# EAGLE design BATT_CPU (EAGLE 9.6.2)
COMPANY: ADAFRUIT INDUSTRIES; DRAWN: KTOWN; REV: B
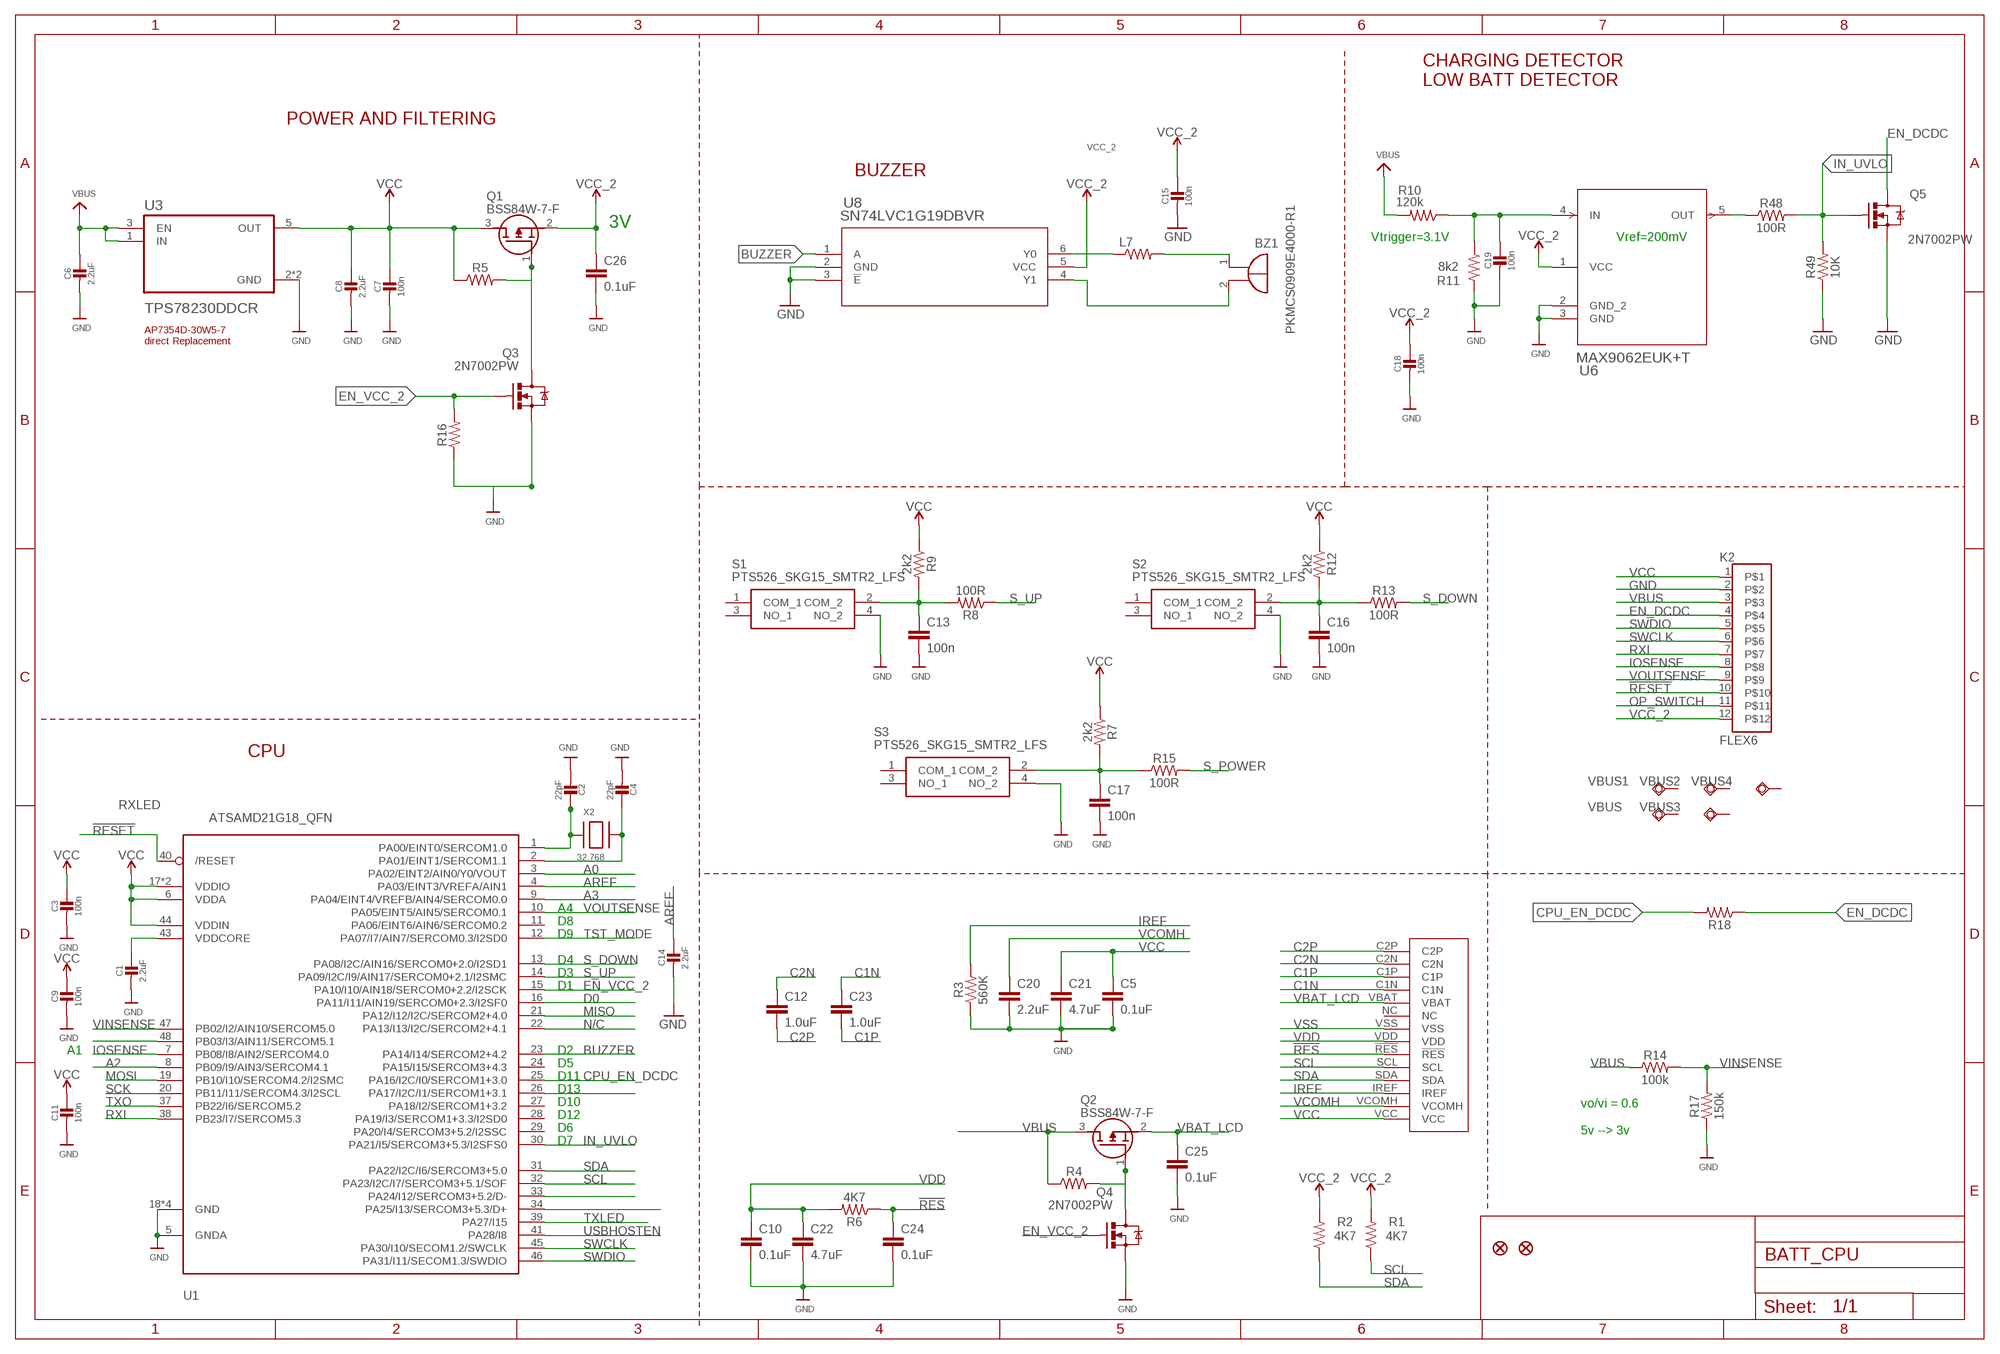
[diagram p0: schematic, sheet 1]

## Parts
BZ1  PKMCS0909E4000-R1  [PKMCS0909]
C1  2.2uF  CAP_CERAMIC0603_NO  [0603-NO]
C2  22pF  CAP_CERAMIC0603_NO  [0603-NO]
C3  100n  CAP_CERAMIC0603_NO  [0603-NO]
C4  22pF  CAP_CERAMIC0603_NO  [0603-NO]
C5  0.1uF  0.1UF-0402-16V-10%  [0402]
C6  2.2uF  CAP_CERAMIC0805-NOOUTLINE  [0805-NO]
C7  100n  CAP_CERAMIC0603_NO  [0603-NO]
C8  2.2uF  CAP_CERAMIC0805-NOOUTLINE  [0805-NO]
C9  100n  CAP_CERAMIC0603_NO  [0603-NO]
C10  0.1uF  0.1UF-0402-16V-10%  [0402]
C11  100n  CAP_CERAMIC0603_NO  [0603-NO]
C12  1.0uF  1.0UF-0402-16V-10%  [0402]
C13  100n  C-EUC0805  [C0805]
C14  2.2uF  CAP_CERAMIC0603_NO  [0603-NO]
C15  100n  CAP_CERAMIC0603_NO  [0603-NO]
C16  100n  C-EUC0805  [C0805]
C17  100n  C-EUC0805  [C0805]
C18  100n  CAP_CERAMIC0603_NO  [0603-NO]
C19  100n  CAP_CERAMIC0603_NO  [0603-NO]
C20  2.2uF  2.2UF-0603-10V-20%  [0603]
C21  4.7uF  4.7UF0603  [0603]
C22  4.7uF  4.7UF0603  [0603]
C23  1.0uF  1.0UF-0402-16V-10%  [0402]
C24  0.1uF  0.1UF-0402-16V-10%  [0402]
C25  0.1uF  0.1UF-0402-16V-10%  [0402]
C26  0.1uF  0.1UF-0402-16V-10%  [0402]
K2  FLEX6  [FLEX6]
L7  MMZ2012Y202BT000  RESISTOR0805-RES  [0805]
Q1  BSS84W-7-F  [SOT65P222X110-3N]
Q2  BSS84W-7-F  [SOT65P222X110-3N]
Q3  2N7002PW  MOSFET-NCHANNEL2N7002PW  [SOT323]
Q4  2N7002PW  MOSFET-NCHANNEL2N7002PW  [SOT323]
Q5  2N7002PW  MOSFET-NCHANNEL2N7002PW  [SOT323]
R1  4K7  RESISTOR0402  [0402]
R2  4K7  RESISTOR0402  [0402]
R3  560K  RESISTOR0402  [0402]
R4  RESISTOR0402  [0402]
R5  RESISTOR0402  [0402]
R6  4K7  RESISTOR0402  [0402]
R7  2k2  RESISTOR0402  [0402]
R8  100R  RESISTOR0402  [0402]
R9  2k2  RESISTOR0402  [0402]
R10  120k  RESISTOR0402  [0402]
R11  8k2  RESISTOR0402  [0402]
R12  2k2  RESISTOR0402  [0402]
R13  100R  RESISTOR0402  [0402]
R14  100k  RESISTOR0402  [0402]
R15  100R  RESISTOR0402  [0402]
R16  RESISTOR0402  [0402]
R17  150k  RESISTOR0402  [0402]
R18  RESISTOR0402  [0402]
R48  100R  RESISTOR0402  [0402]
R49  10K  RESISTOR0402  [0402]
S1  PTS526_SKG15_SMTR2_LFS  [PTS526SKG15SMTR2LFS]
S2  PTS526_SKG15_SMTR2_LFS  [PTS526SKG15SMTR2LFS]
S3  PTS526_SKG15_SMTR2_LFS  [PTS526SKG15SMTR2LFS]
U1  ATSAMD21G18_QFN  ATSAMD21J_QFN  [TQFN48_7MM]
U3  TPS78230DDCR  [SOT95P280X110-5N]
U6  MAX9062EUK+T  [21-0057F_MXM]
U8  SN74LVC1G19DBVR  [DBV6]
U$30  64X32_OLED_049  [LCD_14_PINS]
U$34  FIDUCIAL""  [FIDUCIAL_1MM]
U$35  FIDUCIAL""  [FIDUCIAL_1MM]
VBUS  TESTPAD_TPSQB1,27  [TESTPAD_B1,27]
VBUS1  TESTPAD_TPSQB1,27  [TESTPAD_B1,27]
VBUS2  TESTPAD_TPSQB1,27  [TESTPAD_B1,27]
VBUS3  TESTPAD_TPSQB1,27  [TESTPAD_B1,27]
VBUS4  TESTPAD_TPSQB1,27  [TESTPAD_B1,27]
X2  32.768  XTAL-3.2X1.5  [XTAL3215]

## Nets
!RES: C24.1 R6.1 U$30.!RES
!RESET: K2.10 U1.40(/RESET)
A0: U1.3(PA02/EINT2/AIN0/Y0/VOUT)
A2: U1.8(PB09/I9/AIN3/SERCOM4.1)
A3: U1.9(PA04/EINT4/VREFB/AIN4/SERCOM0.0)
AREF: C14.1 U1.4(PA03/EINT3/VREFA/AIN1)
BUZZER: U1.23(PA14/I14/SERCOM2+4.2) U8.1(A)
C1N: C23.1 U$30.C1N
C1P: C23.2 U$30.C1P
C2N: C12.1 U$30.C2N
C2P: C12.2 U$30.C2P
CPU_EN_DCDC: R18.2 U1.25(PA16/I2C/I0/SERCOM1+3.0)
D0: U1.16(PA11/I11/AIN19/SERCOM0+2.3/I2SF0)
EN_DCDC: K2.4 Q5.3(D) R18.1
EN_VCC_2: Q3.1(G) Q4.1(G) R16.2 U1.15(PA10/I10/AIN18/SERCOM0+2.2/I2SCK)
GND: C1.2 C2.2 C3.2 C4.2 C5.2 C6.2 C7.2 C8.2 C9.2 C10.2 C11.2 C13.2 C14.2 C15.2 C16.2 C17.2 C18.2 C19.2 C20.2 C21.2 C22.2 C24.2 C25.2 C26.2 K2.2 Q3.2(S) Q4.2(S) Q5.2(S) R3.1 R11.2 R16.1 R17.1 R49.1 S1.4(NO_2) S2.4(NO_2) S3.4(NO_2) U1.5(GNDA) U1.18(GND) U1.35(GND) U1.42(GND) U1.THERMAL(GND) U3.2(GND) U3.4(GND) U6.2(GND_2) U6.3(GND) U8.2(GND) U8.3(!E)
IN_UVLO: Q5.1(G) R48.2 R49.2 U1.30(PA21/I5/SERCOM3+5.3/I2SFS0)
IOSENSE: K2.8 U1.7(PB08/I8/AIN2/SERCOM4.0)
IREF: R3.2 U$30.IREF
MISO: U1.21(PA12/I12/I2C/SERCOM2+4.0)
MOSI: U1.19(PB10/I10/SERCOM4.2/I2SMC)
N$1: C17.1 R7.2 R15.1 S3.2(COM_2)
N$2: C13.1 R8.2 R9.2 S1.2(COM_2)
N$3: C16.1 R12.2 R13.1 S2.2(COM_2)
N$4: Q2.1(G) Q4.3(D) R4.2
N$5: C2.1 U1.1(PA00/EINT0/SERCOM1.0) X2.P$1
N$6: Q1.1(G) Q3.3(D) R5.2
N$7: C4.1 U1.2(PA01/EINT1/SERCOM1.1) X2.P$2
N$8: U1.39(PA27/I15)
N$9: U1.22(PA13/I13/I2C/SERCOM2+4.1)
N$10: C19.1 R10.1 R11.1 U6.4(IN)
N$11: U1.34(PA25/I13/SERCOM3+5.3/D+)
N$12: U1.41(PA28/I8)
N$13: U1.48(PB03/I3/AIN11/SERCOM5.1)
N$14: U1.33(PA24/I12/SERCOM3+5.2/D-)
N$17: L7.1 U8.6(Y0)
N$19: BZ1.1(+) L7.2
N$22: BZ1.2(-) U8.4(Y1)
N$58: R48.1 U6.5(OUT)
OP_SWITCH: K2.11 U1.26(PA17/I2C/I1/SERCOM1+3.1)
RXI: K2.7 U1.38(PB23/I7/SERCOM5.3)
S_DOWN: R13.2 U1.13(PA08/I2C/AIN16/SERCOM0+2.0/I2SD1)
S_POWER: R15.2
S_UP: R8.1 U1.14(PA09/I2C/I9/AIN17/SERCOM0+2.1/I2SMC)
SCK: U1.20(PB11/I11/SERCOM4.3/I2SCL)
SCL: R1.1 U1.32(PA23/I2C/I7/SERCOM3+5.1/SOF) U$30.SCL
SDA: R2.1 U1.31(PA22/I2C/I6/SERCOM3+5.0) U$30.SDA
SWCLK: K2.6 U1.45(PA30/I10/SECOM1.2/SWCLK)
SWDIO: K2.5 U1.46(PA31/I11/SECOM1.3/SWDIO)
TST_MODE: U1.12(PA07/I7/AIN7/SERCOM0.3/I2SD0)
TXO: U1.37(PB22/I6/SERCOM5.2)
VBAT_LCD: C25.1 Q2.2(S) U$30.VBAT
VBUS: C6.1 K2.3 Q2.3(D) R4.1 R10.2 R14.1 U3.1(IN) U3.3(EN)
VCC: C3.1 C5.1 C7.1 C8.1 C9.1 C11.1 C21.1 K2.1 Q1.3(D) R5.1 R7.1 R9.1 R12.1 U1.6(VDDA) U1.17(VDDIO) U1.36(VDDIO) U1.44(VDDIN) U3.5(OUT) U$30.VCC
VCC_2: C15.1 C18.1 C26.1 K2.12 Q1.2(S) R1.2 R2.2 U6.1(VCC) U8.5(VCC)
VCOMH: C20.1 U$30.VCOMH
VDD: C10.1 C22.1 R6.2 U$30.VDD
VDDCORE: C1.1 U1.43(VDDCORE)
VINSENSE: R14.2 R17.2 U1.47(PB02/I2/AIN10/SERCOM5.0)
VOUTSENSE: K2.9 U1.10(PA05/EINT5/AIN5/SERCOM0.1)
VSS: U$30.VSS
Unconnected: S1.1(COM_1) S1.3(NO_1) S2.1(COM_1) S2.3(NO_1) S3.1(COM_1) S3.3(NO_1) U1.11(PA06/EINT6/AIN6/SERCOM0.2) U1.24(PA15/I15/SERCOM3+4.3) U1.27(PA18/I2/SERCOM1+3.2) U1.28(PA19/I3/SERCOM1+3.3/I2SD0) U1.29(PA20/I4/SERCOM3+5.2/I2SSC) U$30.NC VBUS1.TP VBUS2.TP VBUS3.TP VBUS4.TP VBUS.TP

## Notes on the sheet
- CHARGING DETECTOR
  LOW BATT DETECTOR
- POWER AND FILTERING
- BUZZER
- 3V
- Vtrigger=3.1V | Vref=200mV
- AP7354D-30W5-7 
  direct Replacement
- CPU
- RXLED
- A4
- D8
- D9
- D4
- D3
- D1
- N/C
- A1 | D2
- D5
- D11
- D13
- D10
- D12
- D6
- vo/vi = 0.6
  
  5v --> 3v
- D7
- TXLED
- USBHOSTEN

## Library data of the parts
BZ1 = buzzer:PKMCS0909E4000-R1: PKMCS0909E4000-R1 Source : http://www.murata.com/~/media/webrenewal/products/sound/sounder/vppt-buzj083-d.ashx
C1-C4 C6-C9 C11 C14 C15 C18 C19 = microbuilder:CAP_CERAMIC: Ceramic Capacitors For new designs, use the packages preceded by an '_' character since they are more reliable: The following footprints should be used on most boards: _0402 - Standard footprint for regular board layouts _0603 - Standard footprint for regular board layouts _0805 - Standard footprint for regular board layouts _1206 - Standard footprint for regular board layouts For extremely tight-pitch boards where space is at a premium, the following 'micro-pitch' footprints can be used (smaller pads, no silkscreen outline, etc.): _0402MP - Micro-pitch footprint for very dense/compact boards _0603MP - Micro-pitch footprint for very dense/compact boards _0805MP - Micro-pitch footprint for very dense/compact boards _1206MP - Micro-pitch footprint for very dense/compact boards
C5 C10 C24-C26 = SparkFun-Capacitors:0.1UF: 0.1µF ceramic capacitors A capacitor is a passive two-terminal electrical component used to store electrical energy temporarily in an electric field.; PROD_ID: CAP-12416
C12 C23 = SparkFun-Capacitors:1.0UF: 1µF ceramic capacitors A capacitor is a passive two-terminal electrical component used to store electrical energy temporarily in an electric field.; PROD_ID: CAP-12417
C13 C16 C17 = rcl:C-EU: CAPACITOR, European symbol; SPICEPREFIX: C
C20 = SparkFun-Capacitors:2.2UF: 2.2µF ceramic capacitors A capacitor is a passive two-terminal electrical component used to store electrical energy temporarily in an electric field.; PROD_ID: CAP-07888
C21 C22 = SparkFun-Capacitors:4.7UF: 4.7µF ceramic capacitors A capacitor is a passive two-terminal electrical component used to store electrical energy temporarily in an electric field.; PROD_ID: CAP-08280
K2 = Flex:FLEX6: WR-FPC 1mm SMT Horiz. Bot. Contact Hinge type WR-FPC 1mm 06 pins Hinge type SMT Horizontal Bottom Contact ;=>Code : Con_FPC_ZIF_1.00_6861xx148922_686106148922 <http://katalog.we-online.de/media/images/eican/Con_FPC_ZIF_1.00_686110148922_pf2.jpg> Details see: http://katalog.we-online.de/em/datasheet/6861xx148922.pdf Created 2014-10-08, Karrer Zheng 2014 (C) Wurth Elektronik
L7 = SparkFun:RESISTOR: Resistor Basic schematic elements and footprints for 0603, 1206, and PTH resistors.
Q1 Q2 = BSS84W-7-F:BSS84W-7-F: Lattice Source: Datasheet <https://www.diodes.com/assets/Datasheets/BSS84W.pdf>; DESCRIPTION: Lattice; HEIGHT: 1.1mm; MANUFACTURER_NAME: Lattice Semiconductor; MANUFACTURER_PART_NUMBER: BSS84W-7-F; MOUSER_PART_NUMBER: N/A; MOUSER_PRICE-STOCK: https://www.mouser.com/Search/Refine.aspx?Keyword=N%2FA
Q3-Q5 = SparkFun-DiscreteSemi:MOSFET-NCHANNEL: Common NMOSFET Parts MFG P/N Store ID Prod ID FDD8780 TRANS-09984 SI7820DN TRANS-11055 FDS6630A IC-08089 2N7002PW TRANS-11151 FQP30N06L COM-10213 TRANS-10060 BSS123LT1G TRANS-08345 BSS138 TRANS-00830 BS170 2N7000; PROD_ID: TRANS-11151
R1-R18 R48 R49 = SparkFun-Resistors:RESISTOR: Generic Resistor Package
S1-S3 = PTS526_SKG15_SMTR2_LFS:PTS526_SKG15_SMTR2_LFS: Tact 5.2 x 5.2, 1.5 mm H, 260gf, G leads, Ground pin, metal actuator Source: Datasheet <https://www.arrow.com/en/products/pts526-skg15-smtr2-lfs/ck>; ARROW_PART_NUMBER: PTS526 SKG15 SMTR2 LFS; ARROW_PRICE-STOCK: https://www.arrow.com/en/products/pts526-skg15-smtr2-lfs/ck?region=nac; DESCRIPTION: Tact 5.2 x 5.2, 1.5 mm H, 260gf, G leads, Ground pin, metal actuator; HEIGHT: 1.6mm; MANUFACTURER_NAME: C & K COMPONENTS; MANUFACTURER_PART_NUMBER: PTS526 SKG15 SMTR2 LFS; MOUSER_PART_NUMBER: 611-PTS526SKG15SMR2L; MOUSER_PRICE-STOCK: https://www.mouser.co.uk/ProductDetail/CK/PTS526-SKG15-SMTR2-LFS?qs=UXgszm6BlbEc7nn5s4cd2Q%3D%3D
U1 = microbuilder:ATSAMD21J
U3 = TPS78230DDCR:TPS78230DDCR: Check prices <https://pricing.snapeda.com/parts/TPS78230DDCR/Texas%20Instruments/view-part?ref=eda>; AVAILABILITY: Good; DESCRIPTION: 150-mA, nano-IQ, low-dropout voltage regulator with enable from -40C to +125C 5-SOT-23-THIN -40 to 125; MF: Texas Instruments; MP: TPS78230DDCR; PACKAGE: SOT-23-THN-5 Texas Instruments; PRICE: None; PURCHASE-URL: https://pricing.snapeda.com/search/part/TPS78230DDCR/?ref=eda
U6 = MAX9062:MAX9062EUK+T; BUILT_BY: EMA_UL_Team; MANUFACTURER_PART_NUMBER: MAX9062EUK+T; SOURCELIBRARY: Maxim_2014-06-20; VENDOR: Maxim Integrated Products
U8 = SN74LVC1G19DBVR:SN74LVC1G19DBVR; DATASHEET_URL: http://www.ti.com/lit/gpn/SN74LVC1G19; DESCRIPTION: 1-of-2 Decoder/Demultiplexer; FAMILY_NAME: LL Decoder, Mux/Demux; GENERIC_PART_NUMBER: SN74LVC1G19; INDUSTRY_STD_PKG_TYPE: SOT-23; MANUFACTURER: Texas Instruments; MANUFACTURER_PART_NUMBER: SN74LVC1G19DBVR; PACKAGE_DESIGNATOR: DBV; PIN_COUNT: 6; VENDOR: Texas Instruments
U$30 = OLED 66 64x48:64X32_OLED_049
U$34 U$35 = microbuilder:FIDUCIAL: Fiducial Alignment Points Various fiducial points for machine vision alignment.; BOM: EXCLUDE
VBUS VBUS1-VBUS4 = BeagleBone_Blue_R3:TESTPAD_TPSQ: Test pad
X2 = adafruit2:XTAL: Low cost SMT crystals, no capacitors included http://www.ladyada.net/library/eagle

## Net classes
2 gnd: width 0.305 mm, drill 0.483 mm, clearance 0.203 mm

## Board
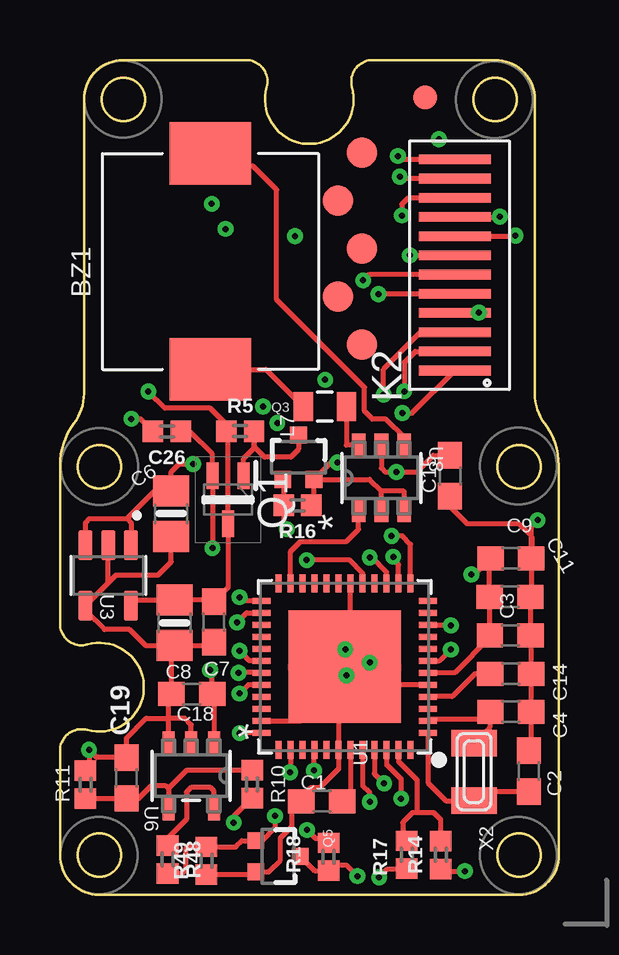
[diagram p1: board, top side]
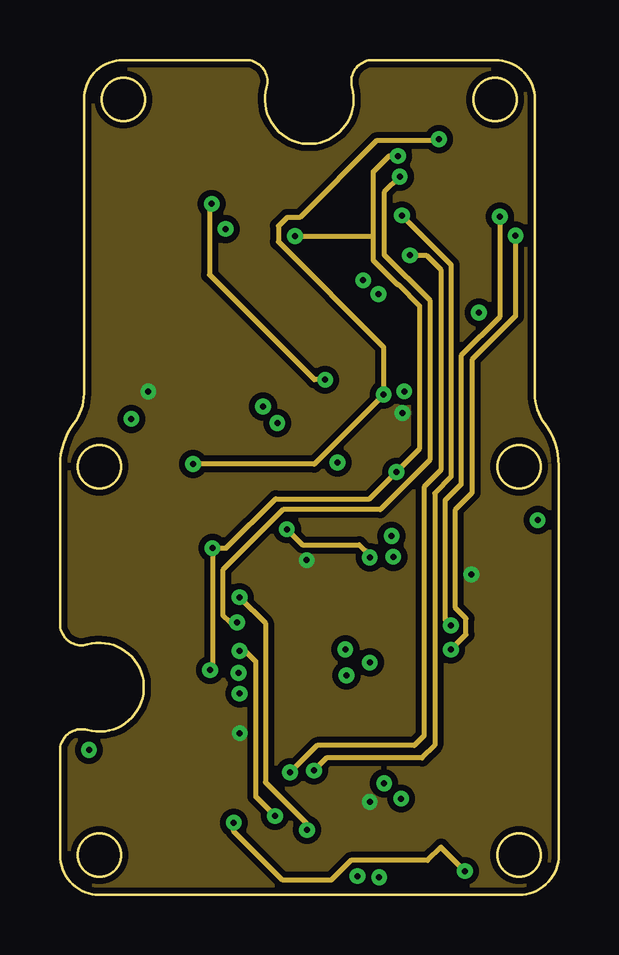
[diagram p2: board, inner layer Route2]
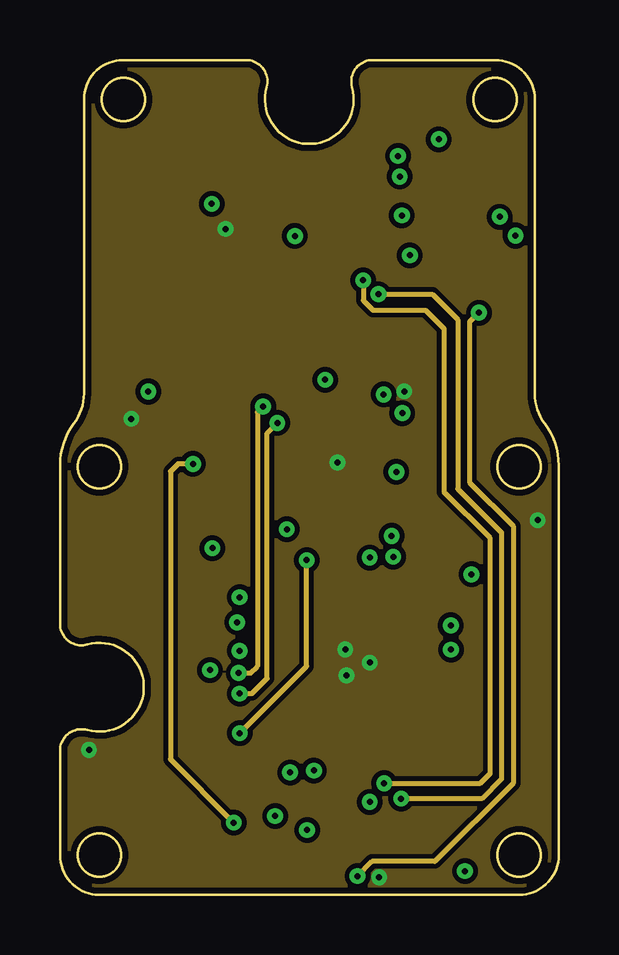
[diagram p3: board, inner layer GND]
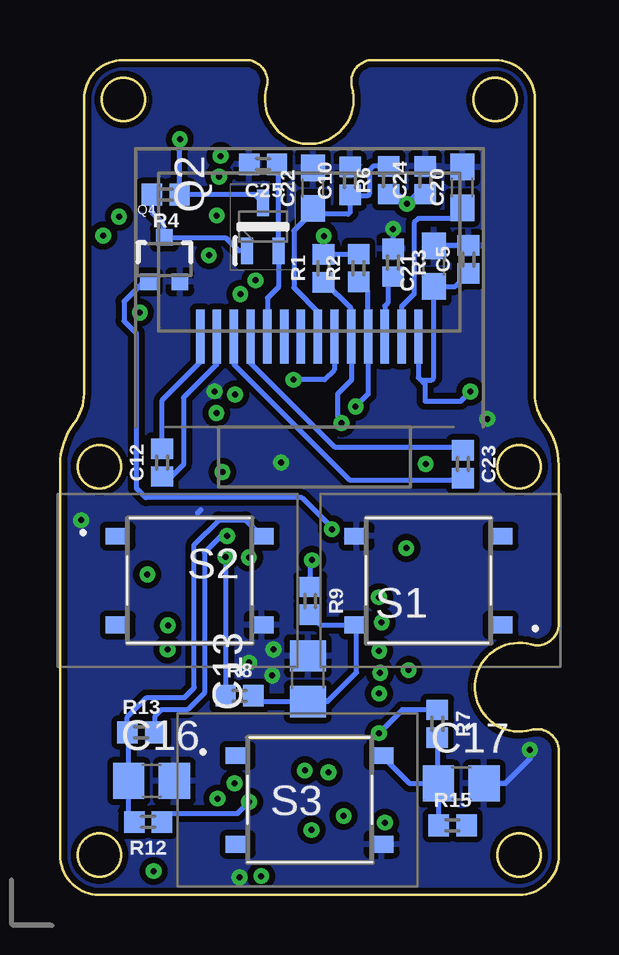
[diagram p4: board, bottom side, seen from below]

Size 20.8 x 34.8 mm. Coordinates in mm from the lower left corner, seen from the top.
Outline: 19.8,33.15 19.8,20.9 arc37 20.22,19.64 arc-37 20.8,17.9 20.8,1.65 arc-90 19.15,0 1.65,0 arc-90 0,1.65 0,6 arc-106 1.14,6.87 arc212 1.14,10.43 arc-106 0,11.3 0,17.9 arc-37 0.58,19.64 arc37 1,20.9 1,33.15 arc-90 2.65,34.8 7.75,34.8 arc-106 8.62,33.66 arc212 12.18,33.66 arc-106 13.05,34.8 18.15,34.8 arc-90 19.8,33.15
Outline: circle at 18.15,33.15 radius 0.9
Outline: circle at 19.15,17.85 radius 0.9
Outline: circle at 19.15,1.65 radius 0.9
Outline: circle at 1.65,1.65 radius 0.9
Outline: circle at 1.65,17.85 radius 0.9
Outline: circle at 2.65,33.15 radius 0.9
Copper layers (1+2*15+16): Top 0.035mm / dielectric 1.5mm / Route2 0.035mm / dielectric 0.15mm / GND 0.035mm / dielectric 0.2mm / Bottom 0.035mm
Design rules "adafruit *": minimum track width 8mil, minimum drill 0.25mm, track to track 8mil, track to pad 8mil, pad to pad 8mil, via to via 8mil, smd to smd 5mil, copper to edge 10mil, drill to drill 8mil, minimum pad ring 10mil, minimum via ring 8mil, stop-mask expansion 2mil, vias tented up to drill 20mil, thermal gap 10mil

### Footprints (pad centres in the part's own frame; a part is rotated, then mirrored left to right if it is on the bottom)
PKMCS0909 = smd 2.6 x 3.4: 1 -4.5,0; 2 4.5,0
0603-NO = smd 1.1 x 1: 1 -0.85,0; 2 0.85,0
0402 = smd 0.85 x 0.9: 1 -0.58,0; 2 0.58,0
0805-NO = smd 1.3 x 1.5: 1 -0.95,0; 2 0.95,0
C0805 = smd 1.3 x 1.5: 1 -0.95,0; 2 0.95,0
0603 = smd 1.1 x 1: 1 -0.85,0; 2 0.85,0
FLEX6 = smd 0.4 x 3: 1 -2.5,-0.25; 2 -1.7,-0.25; 3 -0.9,-0.25; 4 -0.1,-0.25; 5 0.7,-0.25; 6 1.5,-0.25; 7 2.3,-0.25; 8 3.1,-0.25; 9 3.9,-0.25; 10 4.7,-0.25; 11 5.5,-0.25; 12 6.3,-0.25
0805 = smd 0.8 x 1.2: 1 -0.9,0; 2 0.9,0
SOT65P222X110-3N = smd 1.1 x 0.5: 1 -1,0.65; 2 -1,-0.65; 3 1,0
SOT323 = smd 0.7 x 0.7: 1 -0.65,-0.925; 2 0.65,-0.925; 3 0,0.925
PTS526SKG15SMTR2LFS = smd 1 x 0.7: 1 -3,1.85; 2 3,1.85; 3 -3,-1.85; 4 3,-1.85
TQFN48_7MM = smd 0.25 x 0.75: 1 -2.75,-3.475; 2 -2.25,-3.475; 3 -1.75,-3.475; 4 -1.25,-3.475; 5 -0.75,-3.475; 6 -0.25,-3.475; 7 0.25,-3.475; 8 0.75,-3.475; 9 1.25,-3.475; 10 1.75,-3.475; 11 2.25,-3.475; 12 2.75,-3.475; 25 2.75,3.475; 26 2.25,3.475; 27 1.75,3.475; 28 1.25,3.475; 29 0.75,3.475; 30 0.25,3.475; 31 -0.25,3.475; 32 -0.75,3.475; 33 -1.25,3.475; 34 -1.75,3.475; 35 -2.25,3.475; 36 -2.75,3.475 | smd 0.75 x 0.25: 13 3.475,-2.75; 14 3.475,-2.25; 15 3.475,-1.75; 16 3.475,-1.25; 17 3.475,-0.75; 18 3.475,-0.25; 19 3.475,0.25; 20 3.475,0.75; 21 3.475,1.25; 22 3.475,1.75; 23 3.475,2.25; 24 3.475,2.75; 37 -3.475,2.75; 38 -3.475,2.25; 39 -3.475,1.75; 40 -3.475,1.25; 41 -3.475,0.75; 42 -3.475,0.25; 43 -3.475,-0.25; 44 -3.475,-0.75; 45 -3.475,-1.25; 46 -3.475,-1.75; 47 -3.475,-2.25; 48 -3.475,-2.75 | smd 4.7 x 4.7: THERMAL 0,0
SOT95P280X110-5N = smd 1.25 x 0.59: 1 -1.255,0.95; 2 -1.255,0; 3 -1.255,-0.95; 4 1.255,-0.95; 5 1.255,0.95
21-0057F_MXM = smd 0.972 x 0.508: 1 -1.362,0.95; 2 -1.362,0; 3 -1.362,-0.95; 4 1.362,-0.95; 5 1.362,0.95
DBV6 = smd 0.972 x 0.568: 1 -1.362,0.95; 2 -1.362,0; 3 -1.362,-0.95; 4 1.362,-0.95; 5 1.362,0; 6 1.362,0.95
LCD_14_PINS = smd 0.35 x 2.25: !RES 5.6,1.125; C1N 2.1,1.125; C1P 1.4,1.125; C2N 0.7,1.125; C2P 0,1.125; IREF 7.7,1.125; NC 3.5,1.125; SCL 6.3,1.125; SDA 7,1.125; VBAT 2.8,1.125; VCC 9.1,1.125; VCOMH 8.4,1.125; VDD 4.9,1.125; VSS 4.2,1.125
FIDUCIAL_1MM = smd 1 x 1: 1 0,0
TESTPAD_B1,27 = smd 1.27 x 1.27: TP 0,0
XTAL3215 = smd 1.1 x 1.9: P$1 1.2,0; P$2 -1.2,0

### Placement (x,y rotation side)
BZ1  6.27,26.4 90 top
C1  10.92,3.9 180 top
C2  19.56,5.15 90 top
C3  18.78,10.8 0 top
C4  18.8,7.63 0 top
C5  3.77,26.49 90 bottom
C6  4.64,15.88 270 top
C7  6.42,11.37 270 top
C8  4.78,11.34 270 top
C9  18.76,12.42 0 top
C10  8.7,29.76 90 bottom
C11  18.8,14.02 0 top
C12  16.54,18.02 90 bottom
C13  10.46,9 90 bottom
C14  18.8,9.21 0 top
C15  16.26,17.46 270 top
C16  16.98,4.75 0 bottom
C17  4.06,4.64 0 bottom
C18  5.5,8.37 180 top
C19  2.77,4.87 90 top
C20  4.02,29.49 90 bottom
C21  5.21,26.21 90 bottom
C22  10.25,29.46 90 bottom
C23  4,17.95 270 bottom
C24  5.57,29.79 90 bottom
C25  12.33,30.45 180 bottom
C26  4.46,19.32 180 top
K2  16.21,24.35 90 top
L7  11.04,20.35 180 top
Q1  7.01,16.47 270 top
Q2  12.34,27.85 90 bottom
Q3  9.94,18.24 0 top
Q4  16.45,26.48 0 bottom
Q5  9.09,1.61 270 top
R1  9.81,26.12 90 bottom
R2  8.35,26.13 90 bottom
R3  6.91,26.35 270 bottom
R4  16.39,29.19 180 bottom
R5  7.51,19.32 0 top
R6  7.09,29.79 90 bottom
R7  5.07,7.13 270 bottom
R8  13.31,8.29 0 bottom
R9  10.36,12.25 270 bottom
R10  8.02,4.61 270 top
R11  1.06,4.59 90 top
R12  17.12,3.04 180 bottom
R13  17.41,6.77 0 bottom
R14  15.88,1.66 90 top
R15  4.43,2.9 0 bottom
R16  9.91,16.23 180 top
R17  14.46,1.67 90 top
R18  11.2,1.58 90 top
R48  4.49,1.47 270 top
R49  6.11,1.42 90 top
S1  5.43,13.1 180 bottom
S2  15.39,13.1 0 bottom
S3  10.39,3.95 0 bottom
U1  11.87,9.51 90 top
U3  2.01,13.31 270 top
U6  5.47,4.96 270 top
U8  13.41,17.38 90 top
U$30  14.95,22.15 0 bottom
U$34  15.22,33.24 0 top
U$35  29.88,1.31 0 top  (outside the outline)
VBUS  12.6,30.94 0 top
VBUS1  11.6,28.94 0 top
VBUS2  12.6,26.94 0 top
VBUS3  11.6,24.94 0 top
VBUS4  12.6,22.94 0 top
X2  17.26,5.12 270 top

### Tracks (layer width: path | path; a pad name or v marks a point on that pad's centre or on a via)
!RES  (via drill 0.25)
  Route2 0.203: v11.06,21.47 10.61,21.47 6.23,25.84 6.23,28.7 v6.33,28.8
  Bottom 0.203: C24.1 5.93,29.21 5.93,29.2 v6.33,28.8 6.74,29.21 R6.1 | U$30.!RES 9.35,21.87 9.76,21.47 v11.06,21.47
!RESET  (via drill 0.25)
  Top 0.203: K2.10 14.51,29.04 14.26,28.79 v14.26,28.32 | v10.59,5.18 10.59,6 U1.40
  Route2 0.203: v14.26,28.32 16.31,26.27 16.31,17.43 15.63,16.75 15.63,6.23 15.1,5.7 11.11,5.7 v10.59,5.18
AREF
  Top 0.203: C14.1 17.31,9.21 16.36,8.27 U1.4
BUZZER
  Top 0.203: U1.23 9.62,14.31 10.03,14.72 11.94,14.72 12.45,15.23 U8.1
C1N
  Bottom 0.203: C23.1 4.12,18.65 9.33,18.65 12.85,22.17 U$30.C1N
C1P
  Bottom 0.203: C23.2 4.07,17.3 8.72,17.3 13.55,22.13 U$30.C1P
C2N
  Bottom 0.203: U$30.C2N 14.25,22.12 15.65,20.73 15.65,17.93 16.14,17.44 C12.1
C2P
  Bottom 0.203: C12.2 16.54,20.62 14.95,22.2 U$30.C2P
CPU_EN_DCDC  (via drill 0.25)
  Top 0.203: U1.25 7.64,12.26 v7.49,12.4 | R18.2 11.03,2.33 10.67,2.33 v10.31,2.7
  Route2 0.203: v10.31,2.7 10.31,2.95 8.56,4.69 8.56,11.33 v7.49,12.4
EN_DCDC  (via drill 0.25)
  Top 0.203: Q5.3 10.62,1 R18.1 11.42,1.23 11.96,1.23 v12.41,0.78 | K2.4 17.45,24.25 v17.47,24.27
  GND 0.203: v17.47,24.27 17.08,23.88 17.08,17.19 18.9,15.37 18.9,4.65 15.63,1.39 13.02,1.39 v12.41,0.78
EN_VCC_2  (via drill 0.25)
  Top 0.203: U1.15 13.62,13.45 13.02,14.06 v12.92,14.06 | Q3.1 9.33,17.28 R16.2 9.33,15.37 v9.46,15.24
  Route2 0.203: v12.92,14.06 12.92,14.14 12.47,14.59 10.11,14.59 v9.46,15.24
  Bottom 0.203: Q4.1 17.3,25.55 18.12,24.73 18.12,23.92 17.61,23.41 17.61,16.95 17.22,16.56 10.71,16.56 9.46,15.31 v9.46,15.24
GND  (via drill 0.25)
  Top 0.203: U3.4 1.12,12.11 | 1.12,12.11 2.01,13 | 2.01,13 U3.2 | 2.01,13 2.34,13.33 4.09,13.33 4.64,13.87 C6.2 | 1.12,12.11 1.12,11.8 1.86,11.06 2.91,11.06 3.58,10.39 C8.2 | R16.1 10.59,16.34 Q3.2 | C11.2 19.65,12.45 C9.2 19.61,10.82 C3.2 19.65,10.79 C14.2 19.66,9.2 19.66,7.62 | 19.66,7.62 C4.2 | C2.2 19.66,6.1 19.66,7.62 | U1.5 13.44,8.76 12.69,9.51 U1.THERMAL | C8.2 6.29,10.39 C7.2 | U8.2 13.41,16.82 | U6.2 5.47,7.09 5.21,7.36 4.53,7.36 | U6.3 4.53,7.36 | 4.53,7.36 4.53,8.25 C18.2 4.65,10.26 C8.2 | 4.53,7.36 3.6,7.36 2.77,6.53 C19.2 1.53,5.72 v1.21,6.04 1.21,5.31 R11.2 | R49.1 8.05,0.84 Q5.2 8.71,0.96 9.19,1.44 9.19,2.37 9.65,2.83 9.66,2.83 9.66,3.49 C1.2 10.07,4.09 10.43,4.45 10.83,4.45 11.62,5.24 U1.42 11.62,9.26 U1.THERMAL | R17.1 14.43,1.06 13.64,1.06 v13.31,0.72 | v14.36,20.99 14.36,22.19 14.81,22.65 K2.2 | C11.2 19.67,14.04 19.67,14.93 19.14,15.46 17,15.46 16.26,16.19 C15.2 | U1.THERMAL 11.95,9.43 v11.95,9.15 10.06,7.26 U1.35 | U1.THERMAL 12.12,9.76 U1.18 | C26.2 3.36,19.84 v2.98,19.84 | Q3.2 12.91,17.31 13.41,16.82 | U8.3 14.36,16.8 14.33,16.83 13.41,16.83 13.41,16.82 | C11.2 19.65,15.35 v19.92,15.62 | Q3.2 11.3,18.02 v11.58,18.02
  Bottom 0.203: C17.2 2.22,4.64 1.2,5.66 v1.2,6.03 v1.21,6.04 | 14.93,16.05 15.08,15.9 | v6.91,27.76 R3.1 | C21.2 5.03,27.06 5.02,27.07 C5.2
  other vias: 11.9,10.23 12.92,9.68
  pour Bottom (isolate 0.254): 1.67,36 19.59,36 22.78,32.81 22.78,-1.19 -2.18,-1.19 -2.18,32.15
  pour GND: -1.77,34.56 -0.41,35.92 19.59,35.92 22.81,32.7 22.81,-1.08 -1.77,-1.08
  pour Top: 9.62,11.76 14.13,11.76 14.13,7.31 9.62,7.31
IN_UVLO  (via drill 0.25)
  Top 0.203: R48.2 5.09,0.89 5.27,1.07 5.27,1.95 5.32,2 R49.2 7.33,2 7.59,2.26 Q5.1 8.42,2.26 8.97,2.8 v8.97,3.28 | U1.30 7.9,9.76 v7.49,10.17
  Route2 0.203: v8.97,3.28 8.16,4.09 8.16,9.74 7.73,10.17 v7.49,10.17
IOSENSE  (via drill 0.25)
  Top 0.203: U1.7 15.83,9.76 16.29,10.22 v16.31,10.22 | K2.8 18.97,27.45 v19,27.48
  Route2 0.203: v19,27.48 19,24.12 17.19,22.3 17.19,16.75 16.5,16.06 16.5,11.95 16.94,11.51 16.94,10.85 v16.31,10.22
IREF
  Bottom 0.203: R3.2 7.13,25.54 7.13,24.67 7.25,24.55 U$30.IREF
N$1
  Bottom 0.203: S3.2 6.23,4.64 C17.1 | C17.1 R15.1 | R7.2 5.07,4.69 C17.1
N$2
  Bottom 0.203: R8.2 12.49,8.05 C13.1 9.64,8.05 8.43,9.27 S1.2 9.94,11.25 R9.2
N$3
  Bottom 0.203: R12.2 17.93,3.27 C16.1 17.93,6.71 R13.1 17.99,7.41 17.18,8.22 15.61,8.22 15.2,8.63 15.2,14.6 14.17,15.63 13.07,15.63 S2.2
N$4
  Bottom 0.203: R4.2 16.97,28.46 16.5,27.99 16.5,27.4 Q4.3 16.41,27.37 13.87,27.37 13.35,26.85 Q2.1
N$5
  Top 0.203: U1.1 15.35,4.67 16.09,3.92 X2.P$1 17.64,4.3 C2.1
N$6
  Top 0.203: Q1.1 7.66,18.18 8.09,18.62 R5.2 8.09,18.68 8.53,18.24 9.62,18.24 9.94,18.56 Q3.3
N$7
  Top 0.203: X2.P$2 17.95,7.01 C4.1 17.62,7.31 15.4,7.31 U1.2
N$10
  Top 0.203: R11.1 C19.1 3.29,4.02 3.83,4.56 4.4,4.56 4.53,4.43 | 4.53,4.43 U6.4 | R10.1 5.28,5.19 4.53,4.43
N$17
  Top 0.203: L7.1 11.94,18.74 U8.6
N$19
  Top 0.203: BZ1.1 8.59,21.9 L7.2
N$22
  Top 0.203: U8.4 14.36,19.05 13.58,19.83 13.03,19.83 12.7,20.16 12.7,21.14 9.04,24.8 9.04,29.39 8.06,30.37 6.81,30.37 BZ1.2
N$58
  Top 0.203: U6.5 6.42,4.33 6.28,4.48 5.47,4.48 5.28,4.29 5.28,3.14 4.49,2.35 R48.1
OP_SWITCH  (via drill 0.25)
  Top 0.203: K2.11 14.25,29.85 v14.17,29.94 | v7.39,11.35 7.79,11.76 U1.26
  Route2 0.203: v14.17,29.94 13.52,29.29 13.52,26.68 15.42,24.78 15.42,18.12 13.36,16.06 9.31,16.06 6.79,13.53 6.79,11.65 7.09,11.35 v7.39,11.35
RXI  (via drill 0.25)
  Top 0.203: U1.38 9.62,5.12 v9.6,5.1 | K2.7 v14.59,26.65 v14.59,26.66
  Route2 0.203: v14.59,26.66 15.28,26.66 15.88,26.06 15.88,17.7 15.18,17 15.18,6.63 14.78,6.23 10.73,6.23 v9.6,5.1
S_DOWN  (via drill 0.25)
  Top 0.203: U1.13 14.62,14.61 14.28,14.96 v13.83,14.96
  Bottom 0.203: v13.83,14.96 14.08,14.96 14.77,14.27 14.77,8.42 15.48,7.71 16.58,7.71 16.83,7.46 R13.2
S_UP  (via drill 0.25)
  Top 0.203: U1.14 14.12,13.76 14.13,13.76 13.9,13.99 v13.9,14.09
  Bottom 0.203: v13.9,14.09 R8.1
SCL  (via drill 0.25)
  Top 0.203: U1.32 7.86,8.76 v7.49,8.39
  GND 0.203: v7.49,8.39 8.01,8.39 8.64,9.02 8.64,19.24 v9.06,19.67
  Bottom 0.203: R1.1 9.76,25.54 8.65,24.43 U$30.SCL 8.65,21.45 9.22,20.88 9.22,19.83 v9.06,19.67
SDA  (via drill 0.25)
  Top 0.203: v7.45,9.25 7.47,9.27 U1.31
  GND 0.203: v7.45,9.25 7.95,9.25 8.23,9.53 8.23,20.12 v8.47,20.36
  Bottom 0.203: R2.1 7.97,25.17 7.97,23.26 U$30.SDA 7.95,20.87 v8.47,20.36
SWCLK  (via drill 0.25)
  Top 0.203: U1.45 13.11,6.02 13.11,5.05 v13.52,4.65 | K2.6 12.88,25.85 v12.64,25.62
  GND 0.203: v12.64,25.62 v12.65,25.61 12.65,24.77 13.05,24.37 15.25,24.37 16.02,23.6 16.02,16.8 17.94,14.87 17.94,5.06 17.53,4.65 v13.52,4.65
SWDIO  (via drill 0.25)
  Top 0.203: U1.46 13.62,5.44 14.23,4.84 v14.23,4.01 | K2.5 16.45,25.04 v13.28,25.04
  GND 0.203: v13.28,25.04 15.53,25.04 16.59,23.97 16.59,16.92 18.41,15.11 18.41,4.83 17.59,4.01 v14.23,4.01
VBAT_LCD
  Bottom 0.203: U$30.VBAT 12.15,24.87 11.69,25.34 Q2.2 11.69,30.39 C25.1
VBUS  (via drill 0.25)
  Top 0.203: U3.3 1.06,15.5 1.24,15.68 2.8,15.68 | 2.8,15.68 2.98,15.5 2.98,14.58 U3.1 | 2.8,15.68 3.96,16.83 C6.1 4.64,17.62 4.97,17.96 v5.55,17.96 | R10.2 7.25,3.26 v7.25,3.01 | R14.1 15.97,0.99 v16.89,0.99 | v13.5,20.86 13.5,21.91 15.04,23.45 K2.3
  Route2 0.203: v5.55,17.96 v5.56,17.95 10.61,17.95 13.5,20.84 v13.5,20.86 13.5,22.83 9.11,27.22 9.11,27.88 9.47,28.24 10,28.24 13.2,31.43 15.73,31.43 v15.8,31.5 | v7.25,3.01 7.25,2.65 9.29,0.61 11.31,0.61 12.13,1.43 15.33,1.43 15.89,1.99 v16.89,0.99
  GND 0.203: v7.25,3.01 4.61,5.65 4.61,17.65 4.92,17.96 v5.55,17.96
  Bottom 0.203: Q2.3 12.68,29.19 R4.1 v15.81,31.49 v15.8,31.5
VCC  (via drill 0.25)
  Top 0.203: U3.5 3.2,12.29 C8.1 4.78,12.31 6.33,12.31 C7.1 7.03,12.83 7.03,15.45 Q1.3 | U1.6 16.46,9.26 17.93,10.73 C3.1 17.91,10.82 C9.1 17.91,13.99 C11.1 17.28,13.36 v17.16,13.36 | U1.17 12.62,13.41 12.09,13.95 v10.29,13.95 | U1.36 7.52,6.76 v7.5,6.74 | U1.44 12.62,4.54 12.92,4.25 v12.92,3.87 | Q1.3 7,15.48 | Q1.3 7.01,19.25 R5.1 6.93,19.62 6.27,20.29 4.38,20.29 v3.69,20.98 | K2.1 14.69,20.08 v14.28,20.08
  GND 0.203: v7.5,6.74 10.29,9.53 v10.29,13.95
  Bottom 0.203: R7.1 6.53,7.71 v7.5,6.74 | v12.92,3.87 v12.92,3.86 13.41,3.37 16.21,3.37 R12.1 | R9.1 10.36,13.87 v10.29,13.95 | C21.1 5.17,25.36 5.09,25.28 | C21.1 4.32,25.36 C5.1 | C21.1 5.21,21.55 5.3,21.46 5.76,21.46 5.85,21.55 U$30.VCC 5.85,21.55 5.57,21.27 5.57,20.58 4.09,20.58 v3.69,20.98
  pour Route2 (isolate 0.254, rank 2): -1.9,36.13 19.38,36.13 22.7,32.81 22.7,-1.08 -1.9,-1.08
VCC_2  (via drill 0.25)
  Top 0.203: U8.5 13.41,17.78 13.56,17.63 v14.03,17.63 14.88,17.63 15.56,18.31 C15.1 | U6.1 6.42,8.29 C18.1 6.35,9.28 v6.26,9.37 | K2.12 14.1,30.65 v14.1,30.8 | C26.1 5.41,19.32 6.36,18.37 Q1.2 v6.36,14.45
  Route2 0.203: v14.1,30.8 13.72,30.8 13.07,30.14 13.07,27.48 | 13.07,27.48 13.07,26.44 14.08,25.43 14.13,25.43 15.01,24.55 15.01,18.61 v14.03,17.63 12.91,16.51 8.99,16.51 6.93,14.45 v6.36,14.45 6.36,9.47 v6.26,9.37 | 13.07,27.48 13.04,27.46 v9.8,27.46
  Bottom 0.203: R2.2 R1.2 v9.81,27.45 v9.8,27.46
VCOMH
  Bottom 0.203: C20.1 4.47,28.19 5.86,28.19 6.03,28.01 6.03,25.03 6.55,24.51 U$30.VCOMH
VDD
  Bottom 0.203: R6.2 7.74,30.37 7.9,30.21 7.9,29.21 7.98,29.13 8.65,29.13 C10.1 8.7,28.45 8.78,28.37 10.01,28.37 C22.1 10.25,28.48 11.05,27.68 11.05,25.31 10,24.26 10,23.33 U$30.VDD
VDDCORE
  Top 0.203: U1.43 12.12,4.26 C1.1
VINSENSE
  Top 0.203: U1.47 14.12,5.55 14.89,4.79 14.89,3.42 | R17.2 14.3,2.41 14.3,3.02 14.7,3.42 14.89,3.42 | R14.2 15.88,3.13 15.59,3.42 14.89,3.42
VOUTSENSE  (via drill 0.25)
  Top 0.203: U1.10 16.27,11.26 v16.3,11.23 | v18.34,28.27 18.32,28.25 K2.9
  Route2 0.203: v18.34,28.27 18.34,24.09 16.72,22.47 16.72,17.1 16.06,16.44 16.06,11.47 v16.3,11.23